# Altium project FOC_Drive.PrjPcb
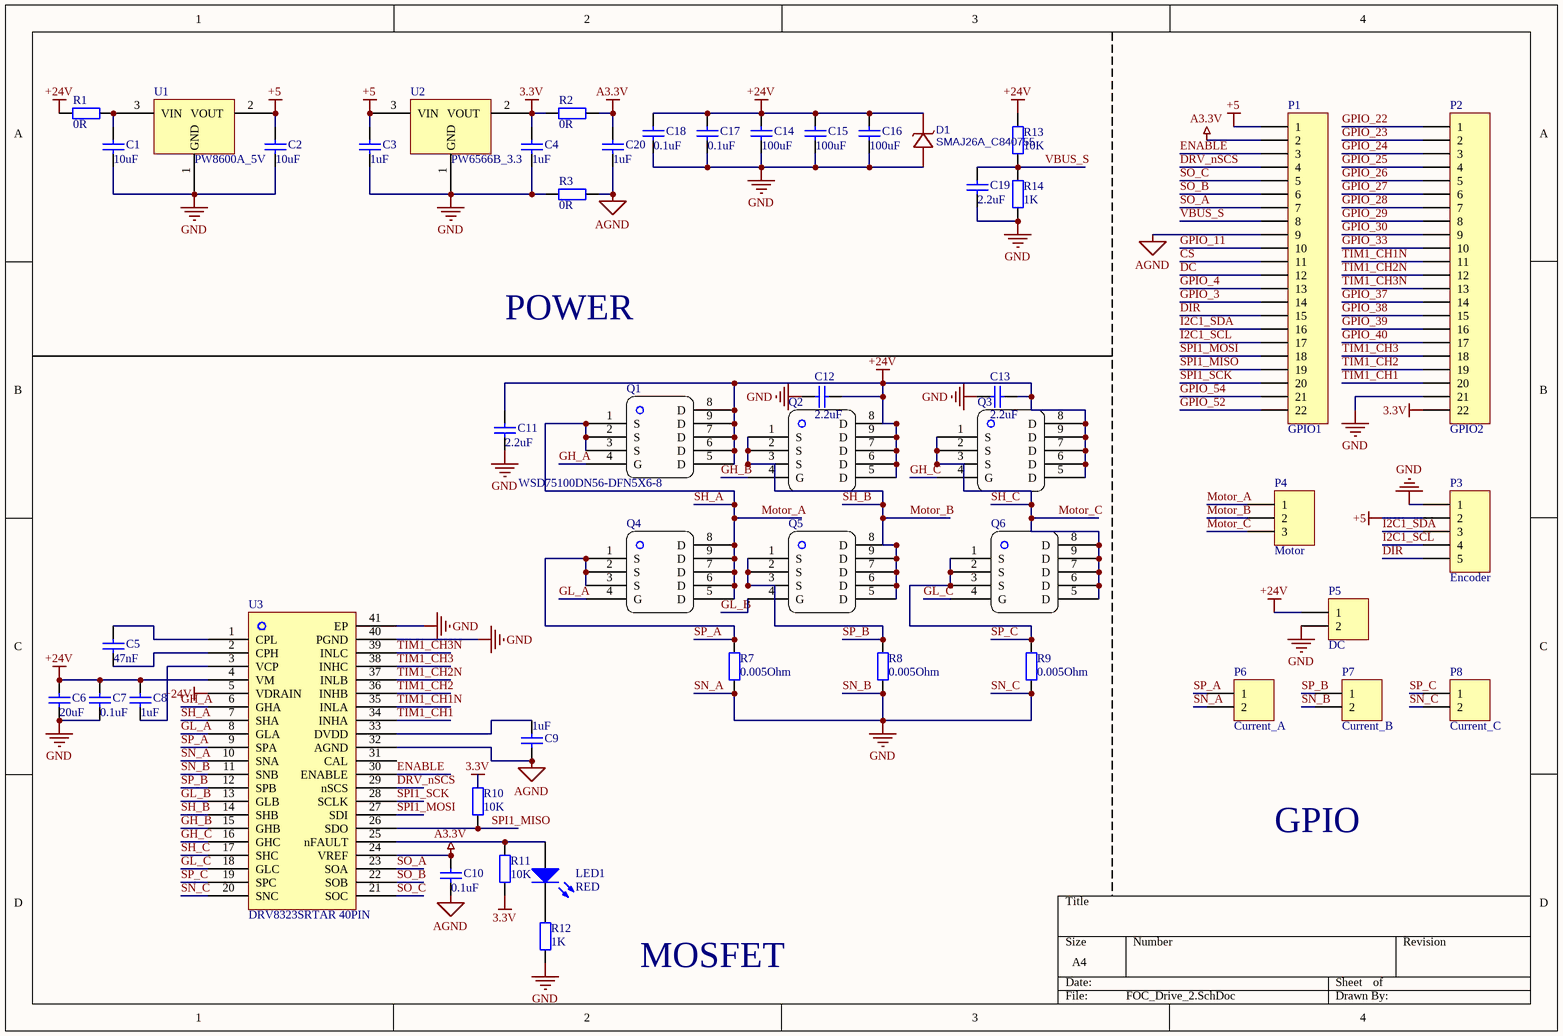
[diagram p0: FOC_Drive_2.SchDoc]
1 sheet, 50 parts. Net scope: global (net labels, ports and power ports of the same name join across sheets).
Board file: FOC_Drive.PcbDoc

## Sheet FOC_Drive_2.SchDoc
size A4

### Parts
C1  value 10uF  [C0603]  (hidden comment: Cap)
C2  value 10uF  [C0603]  (hidden comment: Cap)
C3  value 1uF  [C0603]  (hidden comment: Cap)
C4  value 1uF  [C0603]  (hidden comment: Cap)
C5  value 47nF  [C0603]  (hidden comment: Cap)
C6  value 20uF  [C0603]  (hidden comment: Cap)
C7  value 0.1uF  [C0603]  (hidden comment: Cap)
C8  value 1uF  [C0603]  (hidden comment: Cap)
C9  value 1uF  [C0603]  (hidden comment: Cap)
C10  value 0.1uF  [C0603]  (hidden comment: Cap)
C11  value 2.2uF  [C0603]  (hidden comment: Cap)
C12  value 2.2uF  [C0603]  (hidden comment: Cap)
C13  value 2.2uF  [C0603]  (hidden comment: Cap)
C14  value 100uF  [C1206]  (hidden comment: Cap)
C15  value 100uF  [C1206]  (hidden comment: Cap)
C16  value 100uF  [C1206]  (hidden comment: Cap)
C17  value 0.1uF  [C0805]  (hidden comment: Cap)
C18  value 0.1uF  [C0805]  (hidden comment: Cap)
C19  value 2.2uF  [C0603]  (hidden comment: Cap)
C20  value 1uF  [C0603]  (hidden comment: Cap)
D1  SMAJ26A_C840755  [SMAJ26A-SMA_L4.3-W2.6-LS5.1-RD]
LED1  RED  [0402-A]
P1  GPIO1  [HDR1X22]
P2  GPIO2  [HDR1X22]
P3  Encoder  [CONN-SMD_5P-P2.00_HX20007-5AWB]
P4  Motor  [CONN-TH_3P-P5.00_KF301-5.0-3P]
P5  DC  [CONN-TH_P5.00_KF301-5.0-2P]
P6  Current_A  [HDR1X2]
P7  Current_B  [HDR1X2]
P8  Current_C  [HDR1X2]
Q1  WSD75100DN56-DFN5X6-8  [WSD75100DN56_DFN-8_L5.8-W4.9-P1.27-LS6.1-BL]
Q2  WSD75100DN56-DFN5X6-8  [WSD75100DN56_DFN-8_L5.8-W4.9-P1.27-LS6.1-BL]  (value not drawn)
Q3  WSD75100DN56-DFN5X6-8  [WSD75100DN56_DFN-8_L5.8-W4.9-P1.27-LS6.1-BL]  (value not drawn)
Q4  WSD75100DN56-DFN5X6-8  [WSD75100DN56_DFN-8_L5.8-W4.9-P1.27-LS6.1-BL]  (value not drawn)
Q5  WSD75100DN56-DFN5X6-8  [WSD75100DN56_DFN-8_L5.8-W4.9-P1.27-LS6.1-BL]  (value not drawn)
Q6  WSD75100DN56-DFN5X6-8  [WSD75100DN56_DFN-8_L5.8-W4.9-P1.27-LS6.1-BL]  (value not drawn)
R1  0R  [R0603]
R2  0R  [R0603]
R3  0R  [R0603]
R7  0.005Ohm  [R2512]
R8  0.005Ohm  [R2512]
R9  0.005Ohm  [R2512]
R10  10K  [R0603]
R11  10K  [R0603]
R12  1K  [R0603]
R13  10K  [R0603]
R14  1K  [R0603]
U1  PW8600A_5V  [SOT23-3_L2.9-W1.6-P1.90-LS2.8-BR]
U2  PW6566B_3.3  [SOT-23-3L_L2.9-W1.3-P1.90-LS2.4-BR]
U3  DRV8323SRTAR 40PIN  [DRV8323SRTAR WQFN-40_L6.0-W6.0-P0.50-TL-EP4.5]

### Nets
3.3V: C4.2 P2.22 R2.1 R10.2 R11.1 U2.2(VOUT)
+5: C2.2 C3.2 P1.1 P3.2 U1.2(VOUT) U2.3(VIN)
+24V: C6.2 C7.2 C8.2 C11.2 C12.1 C13.1 C14.2 C15.2 C16.2 C17.2 C18.2 D1.1(C) P5.1 Q1.5(D) Q1.6(D) Q1.7(D) Q1.8(D) Q1.9(D) Q2.5(D) Q2.6(D) Q2.7(D) Q2.8(D) Q2.9(D) Q3.5(D) Q3.6(D) Q3.7(D) Q3.8(D) Q3.9(D) R1.1 R13.2 U3.4(VM) U3.5(VDRAIN)
A3.3V: C10.2 C20.2 P1.2 R2.2 U3.24(VREF)
AGND: C9.1 C10.1 C20.1 P1.9 R3.2 U3.32(AGND)
SN_A: C1.1 C2.1 C3.1 C4.1 C6.1 C7.1 C11.1 C12.2 C13.2 C14.1 C15.1 C16.1 C17.1 C18.1 C19.1 D1.2(A) P2.21 P3.1 P5.2 P6.2 P7.2 P8.2 R3.1 R7.1 R8.1 R9.1 R12.1 R14.1 U1.1(GND) U2.1(GND) U3.10(SNA) U3.11(SNB) U3.20(SNC) U3.40(PGND) U3.41(EP)  [also labelled GND, SN_B, SN_C]
CS: P1.11
DC: P1.12
DIR: P1.15 P3.5
DRV_nSCS: P1.4 U3.29(nSCS)
ENABLE: P1.3 U3.30(ENABLE)
GH_A: Q1.4(G) U3.6(GHA)
GH_B: Q2.4(G) U3.15(GHB)
GH_C: Q3.4(G) U3.16(GHC)
GL_A: Q4.4(G) U3.8(GLA)
GL_B: Q5.4(G) U3.13(GLB)
GL_C: Q6.4(G) U3.18(GLC)
GPIO_3: P1.14
GPIO_4: P1.13
GPIO_11: P1.10
GPIO_22: P2.1
GPIO_23: P2.2
GPIO_24: P2.3
GPIO_25: P2.4
GPIO_26: P2.5
GPIO_27: P2.6
GPIO_28: P2.7
GPIO_29: P2.8
GPIO_30: P2.9
GPIO_33: P2.10
GPIO_37: P2.14
GPIO_38: P2.15
GPIO_39: P2.16
GPIO_40: P2.17
GPIO_52: P1.22
GPIO_54: P1.21
I2C1_SCL: P1.17 P3.4
I2C1_SDA: P1.16 P3.3
Motor_A: P4.1 Q1.1(S) Q1.2(S) Q1.3(S) Q4.5(D) Q4.6(D) Q4.7(D) Q4.8(D) Q4.9(D) U3.7(SHA)  [also labelled SH_A]
Motor_B: P4.2 Q2.1(S) Q2.2(S) Q2.3(S) Q5.5(D) Q5.6(D) Q5.7(D) Q5.8(D) Q5.9(D) U3.14(SHB)  [also labelled SH_B]
Motor_C: P4.3 Q3.1(S) Q3.2(S) Q3.3(S) Q6.5(D) Q6.6(D) Q6.7(D) Q6.8(D) Q6.9(D) U3.17(SHC)  [also labelled SH_C]
SO_A: P1.7 U3.23(SOA)
SO_B: P1.6 U3.22(SOB)
SO_C: P1.5 U3.21(SOC)
SP_A: P6.1 Q4.1(S) Q4.2(S) Q4.3(S) R7.2 U3.9(SPA)
SP_B: P7.1 Q5.1(S) Q5.2(S) Q5.3(S) R8.2 U3.12(SPB)
SP_C: P8.1 Q6.1(S) Q6.2(S) Q6.3(S) R9.2 U3.19(SPC)
SPI1_MISO: P1.19 R10.1 U3.26(SDO)
SPI1_MOSI: P1.18 U3.27(SDI)
SPI1_SCK: P1.20 U3.28(SCLK)
TIM1_CH1: P2.20 U3.34(INHA)
TIM1_CH1N: P2.11 U3.35(INLA)
TIM1_CH2: P2.19 U3.36(INHB)
TIM1_CH2N: P2.12 U3.37(INLB)
TIM1_CH3: P2.18 U3.38(INHC)
TIM1_CH3N: P2.13 U3.39(INLC)
VBUS_S: C19.2 P1.8 R13.1 R14.2
NetC1_2: C1.2 R1.2 U1.3(VIN)
NetC5_1: C5.1 U3.2(CPH)
NetC5_2: C5.2 U3.1(CPL)
NetC8_1: C8.1 U3.3(VCP)
NetC9_2: C9.2 U3.33(DVDD)
NetLED1_1: LED1.1(A) R11.2 U3.25(nFAULT)
NetLED1_2: LED1.2(K) R12.2

Not connected (* = marked no-connect by the designer): U3 31(CAL)

### Notes on the sheet
- POWER
- GPIO
- MOSFET

### Library data of the parts
C1-C20 = Cap: Capacitor 50V; Published: 8-Jun-2000; LatestRevisionDate: 17-Jul-2002; LatestRevisionNote: Re-released for DXP Platform.; PackageReference: RAD-0.3; Publisher: Altium Limited; PackageDescription: Radial Cap, Thru-Hole; 2 Leads; 0.3 in Pin Spacing
D1 = SMAJ26A_C840755: BOM_Manufacturer: MDD（Microdiode Electronics）; Contributor: LCSC; BOM_Supplier: LCSC; BOM_Supplier Part: C840755; BOM_Manufacturer Part: SMAJ26A; BOM_JLCPCB Part Class: Extended Part; spicePre: D; spiceSymbolName: SMAJ26A_C840755
LED1 = LED2: Typical RED, GREEN, YELLOW, AMBER GaAs LED; Published: 8-Jun-2000; LatestRevisionDate: 17-Jul-2002; LatestRevisionNote: Re-released for DXP Platform.; PackageVersion: Feb-2002; PackageReference: 3.2X1.6X1.1; Publisher: Altium Limited; PackageDescription: SM LED; 2 Flat Leads
P1 P2 = Header 22: Header, 22-Pin; LatestRevisionDate: 17-Jul-2002; LatestRevisionNote: Re-released for DXP Platform.; Publisher: Altium Limited
P3 = Header 5: Header, 5-Pin; LatestRevisionDate: 17-Jul-2002; LatestRevisionNote: Re-released for DXP Platform.; Publisher: Altium Limited
P4 = Header 3: Header, 3-Pin; LatestRevisionDate: 17-Jul-2002; LatestRevisionNote: Re-released for DXP Platform.; Publisher: Altium Limited
P5-P8 = Header 2: Header, 2-Pin; LatestRevisionDate: 17-Jul-2002; LatestRevisionNote: Re-released for DXP Platform.; Publisher: Altium Limited
R1-R3 R7-R14 = Res2: Resistor; Published: 8-Jun-2000; LatestRevisionDate: 17-Jul-2002; LatestRevisionNote: Re-released for DXP Platform.; PackageReference: AXIAL-0.4; Publisher: Altium Limited; PackageDescription: Axial Device, Thru-Hole; 2 Leads; 0.4 in Pin Spacing
U1 U2 = AMS1117_3.3 SOT-89